# EAGLE design servo_shield_v1 (EAGLE 6.3)
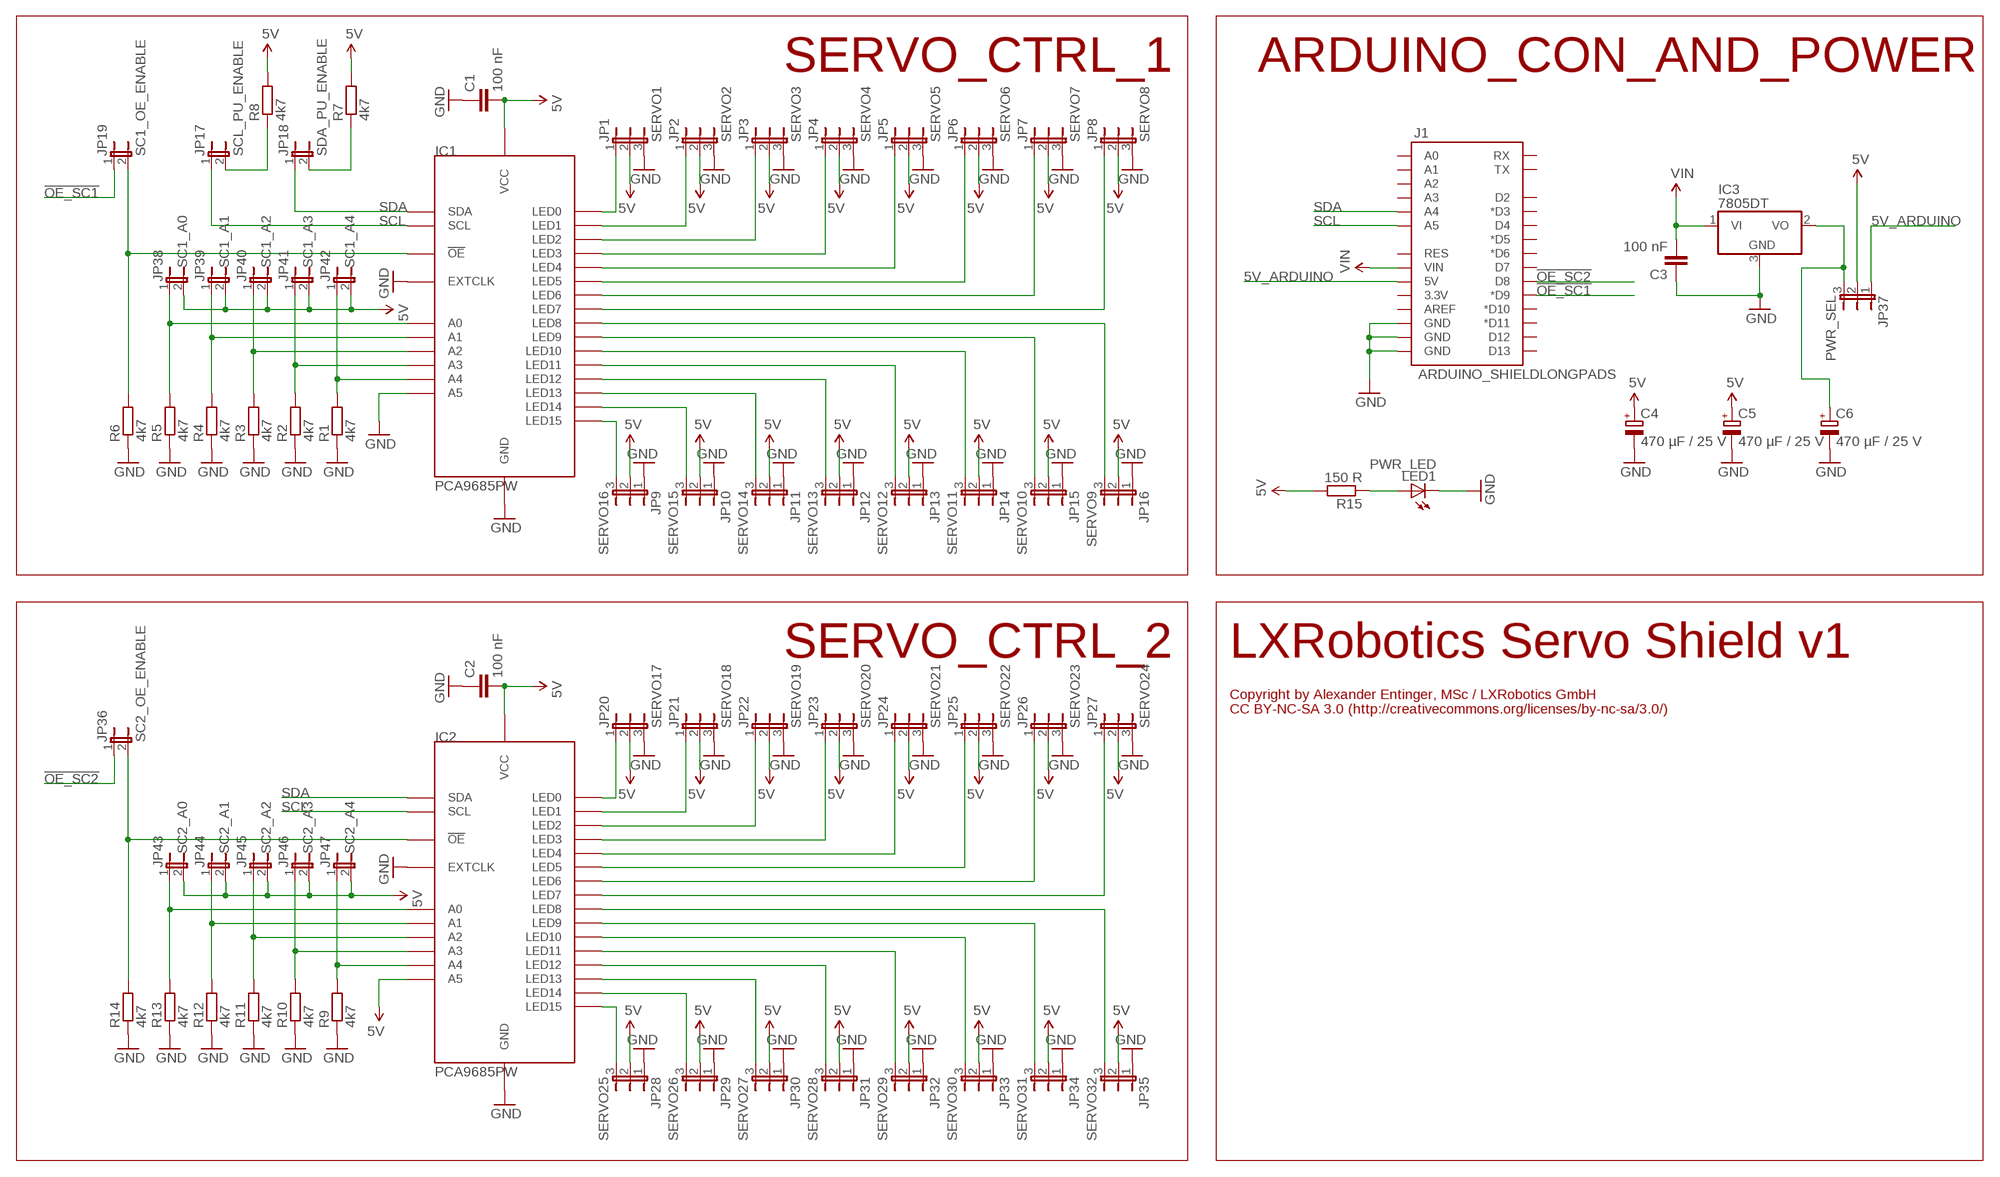
[diagram p0: schematic, sheet 1]

## Parts
C1  100 nF  C-EUC0805K  [C0805K]
C2  100 nF  C-EUC0805K  [C0805K]
C3  100 nF  C-EUC0805K  [C0805K]
C4  470 µF / 25 V  CPOL-EUE5-10.5  [E5-10,5]
C5  470 µF / 25 V  CPOL-EUE5-10.5  [E5-10,5]
C6  470 µF / 25 V  CPOL-EUE5-10.5  [E5-10,5]
IC1  PCA9685PW  [TSSOP28]
IC2  PCA9685PW  [TSSOP28]
IC3  7805DT  [TO252]
J1  ARDUINO_SHIELDLONGPADS  [DUEMILANOVE_SHIELD_LONGPADS]
JP1  SERVO1  JP2E  [JP2]
JP2  SERVO2  JP2E  [JP2]
JP3  SERVO3  JP2E  [JP2]
JP4  SERVO4  JP2E  [JP2]
JP5  SERVO5  JP2E  [JP2]
JP6  SERVO6  JP2E  [JP2]
JP7  SERVO7  JP2E  [JP2]
JP8  SERVO8  JP2E  [JP2]
JP9  SERVO16  JP2E  [JP2]
JP10  SERVO15  JP2E  [JP2]
JP11  SERVO14  JP2E  [JP2]
JP12  SERVO13  JP2E  [JP2]
JP13  SERVO12  JP2E  [JP2]
JP14  SERVO11  JP2E  [JP2]
JP15  SERVO10  JP2E  [JP2]
JP16  SERVO9  JP2E  [JP2]
JP17  SCL_PU_ENABLE  JP1E  [JP1]
JP18  SDA_PU_ENABLE  JP1E  [JP1]
JP19  SC1_OE_ENABLE  JP1E  [JP1]
JP20  SERVO17  JP2E  [JP2]
JP21  SERVO18  JP2E  [JP2]
JP22  SERVO19  JP2E  [JP2]
JP23  SERVO20  JP2E  [JP2]
JP24  SERVO21  JP2E  [JP2]
JP25  SERVO22  JP2E  [JP2]
JP26  SERVO23  JP2E  [JP2]
JP27  SERVO24  JP2E  [JP2]
JP28  SERVO25  JP2E  [JP2]
JP29  SERVO26  JP2E  [JP2]
JP30  SERVO27  JP2E  [JP2]
JP31  SERVO28  JP2E  [JP2]
JP32  SERVO29  JP2E  [JP2]
JP33  SERVO30  JP2E  [JP2]
JP34  SERVO31  JP2E  [JP2]
JP35  SERVO32  JP2E  [JP2]
JP36  SC2_OE_ENABLE  JP1E  [JP1]
JP37  PWR_SEL  JP2E  [JP2]
JP38  SC1_A0  JP1E  [JP1]
JP39  SC1_A1  JP1E  [JP1]
JP40  SC1_A2  JP1E  [JP1]
JP41  SC1_A3  JP1E  [JP1]
JP42  SC1_A4  JP1E  [JP1]
JP43  SC2_A0  JP1E  [JP1]
JP44  SC2_A1  JP1E  [JP1]
JP45  SC2_A2  JP1E  [JP1]
JP46  SC2_A3  JP1E  [JP1]
JP47  SC2_A4  JP1E  [JP1]
LED1  PWR_LED  LEDCHIPLED_0805  [CHIPLED_0805]
R1  4k7  R-EU_R0805W  [R0805W]
R2  4k7  R-EU_R0805W  [R0805W]
R3  4k7  R-EU_R0805W  [R0805W]
R4  4k7  R-EU_R0805W  [R0805W]
R5  4k7  R-EU_R0805W  [R0805W]
R6  4k7  R-EU_R0805W  [R0805W]
R7  4k7  R-EU_R0805W  [R0805W]
R8  4k7  R-EU_R0805W  [R0805W]
R9  4k7  R-EU_R0805W  [R0805W]
R10  4k7  R-EU_R0805W  [R0805W]
R11  4k7  R-EU_R0805W  [R0805W]
R12  4k7  R-EU_R0805W  [R0805W]
R13  4k7  R-EU_R0805W  [R0805W]
R14  4k7  R-EU_R0805W  [R0805W]
R15  150 R  R-EU_R0805W  [R0805W]

## Nets
5V: C1.2 C2.2 C4.+ C5.+ IC1.28(VCC) IC2.24(A5) IC2.28(VCC) JP1.2 JP2.2 JP3.2 JP4.2 JP5.2 JP6.2 JP7.2 JP8.2 JP9.2 JP10.2 JP11.2 JP12.2 JP13.2 JP14.2 JP15.2 JP16.2 JP20.2 JP21.2 JP22.2 JP23.2 JP24.2 JP25.2 JP26.2 JP27.2 JP28.2 JP29.2 JP30.2 JP31.2 JP32.2 JP33.2 JP34.2 JP35.2 JP37.2 JP38.2 JP39.2 JP40.2 JP41.2 JP42.2 JP43.2 JP44.2 JP45.2 JP46.2 JP47.2 R7.2 R8.2 R15.2
5V_ARDUINO: J1.5V JP37.1
!OE_SC1: J1.D9(*D9) JP19.1
!OE_SC2: J1.D8 JP36.1
GND: C1.1 C2.1 C3.1 C4.- C5.- C6.- IC1.14(GND) IC1.24(A5) IC1.25(EXTCLK) IC2.14(GND) IC2.25(EXTCLK) IC3.3(GND) J1.GND@0(GND) J1.GND@1(GND) J1.GND@2(GND) JP1.3 JP2.3 JP3.3 JP4.3 JP5.3 JP6.3 JP7.3 JP8.3 JP9.1 JP10.1 JP11.1 JP12.1 JP13.1 JP14.1 JP15.1 JP16.1 JP20.3 JP21.3 JP22.3 JP23.3 JP24.3 JP25.3 JP26.3 JP27.3 JP28.1 JP29.1 JP30.1 JP31.1 JP32.1 JP33.1 JP34.1 JP35.1 LED1.C R1.1 R2.1 R3.1 R4.1 R5.1 R6.1 R9.1 R10.1 R11.1 R12.1 R13.1 R14.1
N$1: IC1.6(LED0) JP1.1
N$2: IC1.7(LED1) JP2.1
N$3: IC1.8(LED2) JP3.1
N$4: IC1.9(LED3) JP4.1
N$5: IC1.10(LED4) JP5.1
N$6: IC1.11(LED5) JP6.1
N$7: IC1.12(LED6) JP7.1
N$8: IC1.13(LED7) JP8.1
N$9: IC1.22(LED15) JP9.3
N$10: IC1.21(LED14) JP10.3
N$11: IC1.20(LED13) JP11.3
N$12: IC1.19(LED12) JP12.3
N$13: IC1.18(LED11) JP13.3
N$14: IC1.17(LED10) JP14.3
N$15: IC1.16(LED9) JP15.3
N$16: IC1.15(LED8) JP16.3
N$17: IC1.5(A4) JP42.1 R1.2
N$18: IC1.4(A3) JP41.1 R2.2
N$19: IC1.3(A2) JP40.1 R3.2
N$20: IC1.2(A1) JP39.1 R4.2
N$21: IC1.1(A0) JP38.1 R5.2
N$22: IC1.23(!OE) JP19.2 R6.2
N$23: C6.+ IC3.2(VO) JP37.3
N$24: IC2.6(LED0) JP20.1
N$25: IC2.7(LED1) JP21.1
N$26: JP17.2 R8.1
N$27: JP18.2 R7.1
N$28: IC2.8(LED2) JP22.1
N$29: IC2.9(LED3) JP23.1
N$30: IC2.10(LED4) JP24.1
N$31: IC2.11(LED5) JP25.1
N$32: IC2.12(LED6) JP26.1
N$33: IC2.13(LED7) JP27.1
N$34: IC2.22(LED15) JP28.3
N$35: IC2.21(LED14) JP29.3
N$36: IC2.20(LED13) JP30.3
N$37: IC2.19(LED12) JP31.3
N$38: IC2.18(LED11) JP32.3
N$39: IC2.17(LED10) JP33.3
N$40: IC2.16(LED9) JP34.3
N$41: IC2.15(LED8) JP35.3
N$42: IC2.5(A4) JP47.1 R9.2
N$43: IC2.4(A3) JP46.1 R10.2
N$44: IC2.3(A2) JP45.1 R11.2
N$45: IC2.2(A1) JP44.1 R12.2
N$46: IC2.1(A0) JP43.1 R13.2
N$47: IC2.23(!OE) JP36.2 R14.2
N$48: LED1.A R15.1
SCL: IC1.26(SCL) IC2.26(SCL) J1.A5 JP17.1
SDA: IC1.27(SDA) IC2.27(SDA) J1.A4 JP18.1
VIN: C3.2 IC3.1(VI) J1.VIN
Unconnected: J1.3.3V J1.A0 J1.A1 J1.A2 J1.A3 J1.AREF J1.D2 J1.D3(*D3) J1.D4 J1.D5(*D5) J1.D6(*D6) J1.D7 J1.D10(*D10) J1.D11(*D11) J1.D12 J1.D13 J1.RES J1.RX J1.TX

## Notes on the sheet
- SERVO_CTRL_1 | ARDUINO_CON_AND_POWER
- SERVO_CTRL_2 | LXRobotics Servo Shield v1
- Copyright by Alexander Entinger, MSc / LXRobotics GmbH 
  CC BY-NC-SA 3.0 (http://creativecommons.org/licenses/by-nc-sa/3.0/)

## Library data of the parts
C1-C3 = resistor:C-EU: CAPACITOR, European symbol
C4-C6 = resistor:CPOL-EU: POLARIZED CAPACITOR, European symbol
IC1 IC2 = lxrobotics_ic:PCA9685
IC3 = linear:78*: Positive VOLTAGE REGULATOR Source: http://cache.national.com/ds/LM/LM78L05.pdf http://www.fairchildsemi.com/ds/LM/LM7805.pdf
J1 = SparkFun-Boards:ARDUINO_SHIELD: Arduino shield footprint
JP1-JP16 JP20-JP35 JP37 = jumper:JP2E: JUMPER
JP17-JP19 JP36 JP38-JP47 = jumper:JP1E: JUMPER
LED1 = led:LED: LED OSRAM: - CHIPLED LG R971, LG N971, LY N971, LG Q971, LY Q971, LO R971, LY R971 LH N974, LH R974 LS Q976, LO Q976, LY Q976 LO Q996 - Hyper CHIPLED LW Q18S LB Q993, LB Q99A, LB R99A - SideLED LS A670, LO A670, LY A670, LG A670, LP A670 LB A673, LV A673, LT A673, LW A673 LH A674 LY A675 LS A676, LA A676, LO A676, LY A676, LW A676 LS A679, LY A679, LG A679 - Hyper Micro SIDELED® LS Y876, LA Y876, LO Y876, LY Y876 LT Y87S - SmartLED LW L88C, LW L88S LB L89C, LB L89S, LG L890 LS L89K, LO L89K, LY L89K LS L896, LA L896, LO L896, LY L896 - TOPLED LS T670, LO T670, LY T670, LG T670, LP T670 LSG T670, LSP T670, LSY T670, LOP T670, LYG T670 LG T671, LOG T671, LSG T671 LB T673, LV T673, LT T673, LW T673 LH T674 LS T676, LA T676, LO T676, LY T676, LB T676, LH T676, LSB T676, LW T676 LB T67C, LV T67C, LT T67C, LS T67K, LO T67K, LY T67K, LW E67C LS E67B, LA E67B, LO E67B, LY E67B, LB E67C, LV E67C, LT E67C LW T67C LS T679, LY T679, LG T679 LS T770, LO T770, LY T770, LG T770, LP T770 LB T773, LV T773, LT T773, LW T773 LH T774 LS E675, LA E675, LY E675, LS T675 LS T776, LA T776, LO T776, LY T776, LB T776 LHGB T686 LT T68C, LB T68C - Hyper Mini TOPLED® LB M676 - Mini TOPLED Santana® LG M470 LS M47K, LO M47K, LY M47K Source: http://www.osram.convergy.de LUXEON: - LUMILED® LXK2-PW12-R00, LXK2-PW12-S00, LXK2-PW14-U00, LXK2-PW14-V00 LXK2-PM12-R00, LXK2-PM12-S00, LXK2-PM14-U00 LXK2-PE12-Q00, LXK2-PE12-R00, LXK2-PE12-S00, LXK2-PE14-T00, LXK2-PE14-U00 LXK2-PB12-K00, LXK2-PB12-L00, LXK2-PB12-M00, LXK2-PB14-N00, LXK2-PB14-P00, LXK2-PB14-Q00 LXK2-PR12-L00, LXK2-PR12-M00, LXK2-PR14-Q00, LXK2-PR14-R00 LXK2-PD12-Q00, LXK2-PD12-R00, LXK2-PD12-S00 LXK2-PH12-R00, LXK2-PH12-S00 LXK2-PL12-P00, LXK2-PL12-Q00, LXK2-PL12-R00 Source: www.luxeon.com KINGBRIGHT: KA-3528ASYC Source: www.kingbright.com
R1-R15 = resistor:R-EU_: RESISTOR, European symbol

## Board
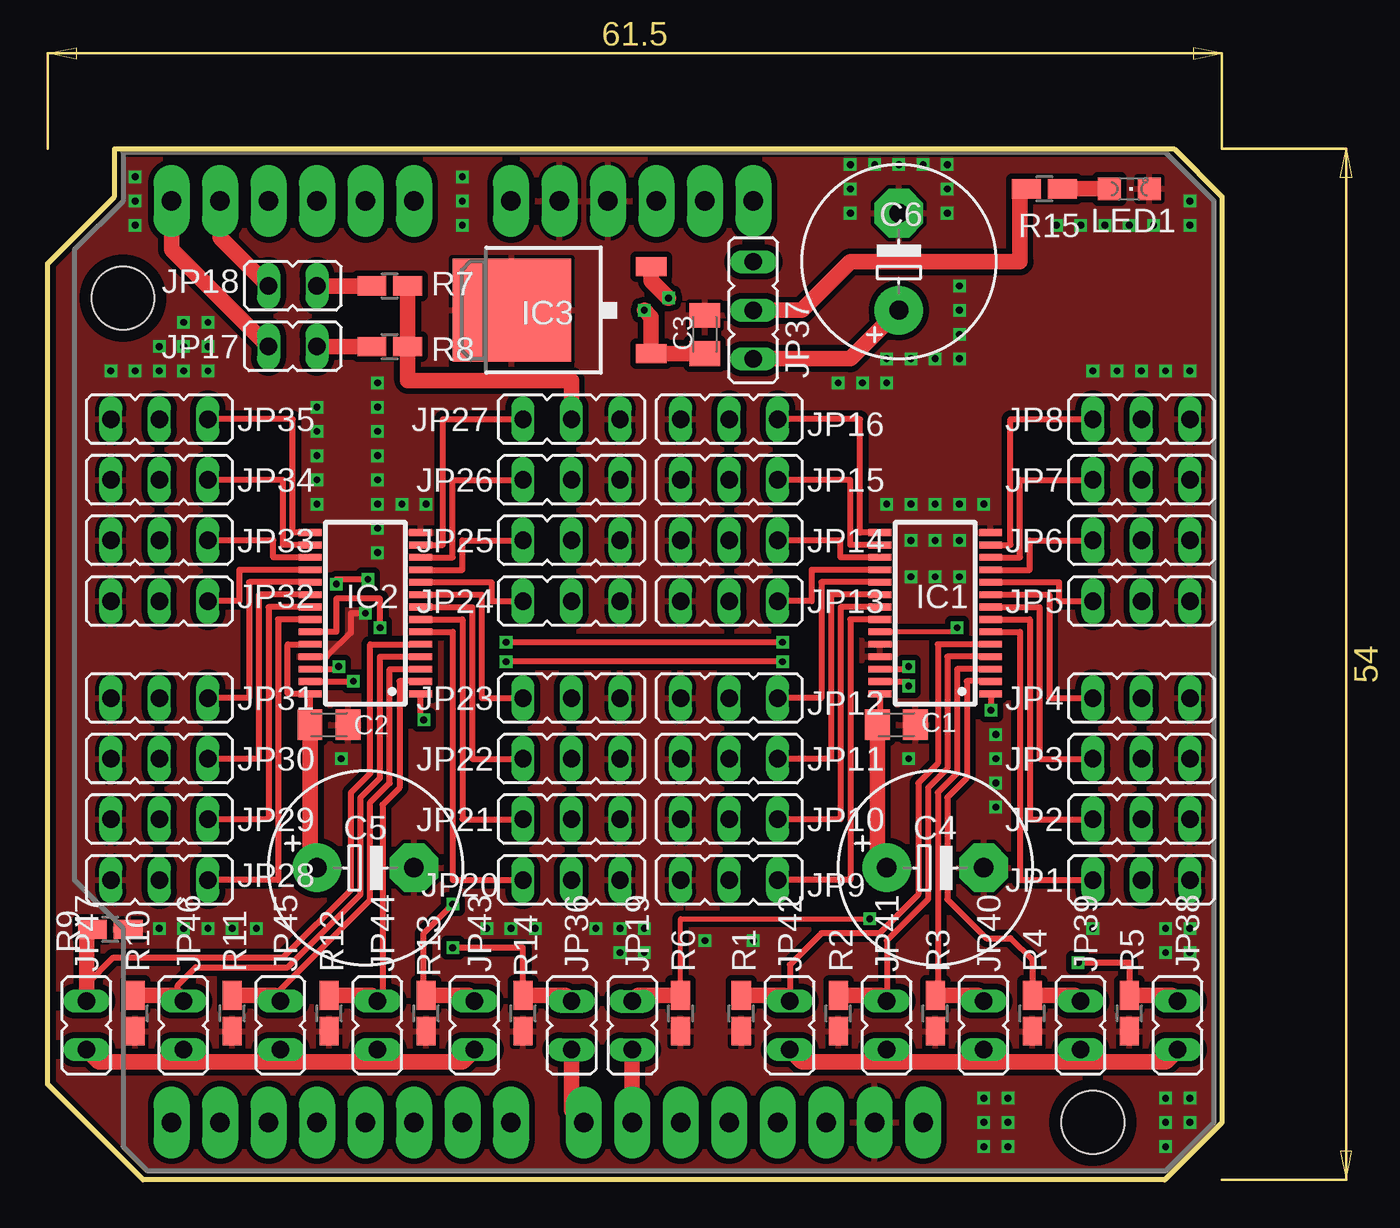
[diagram p1: board, top side]
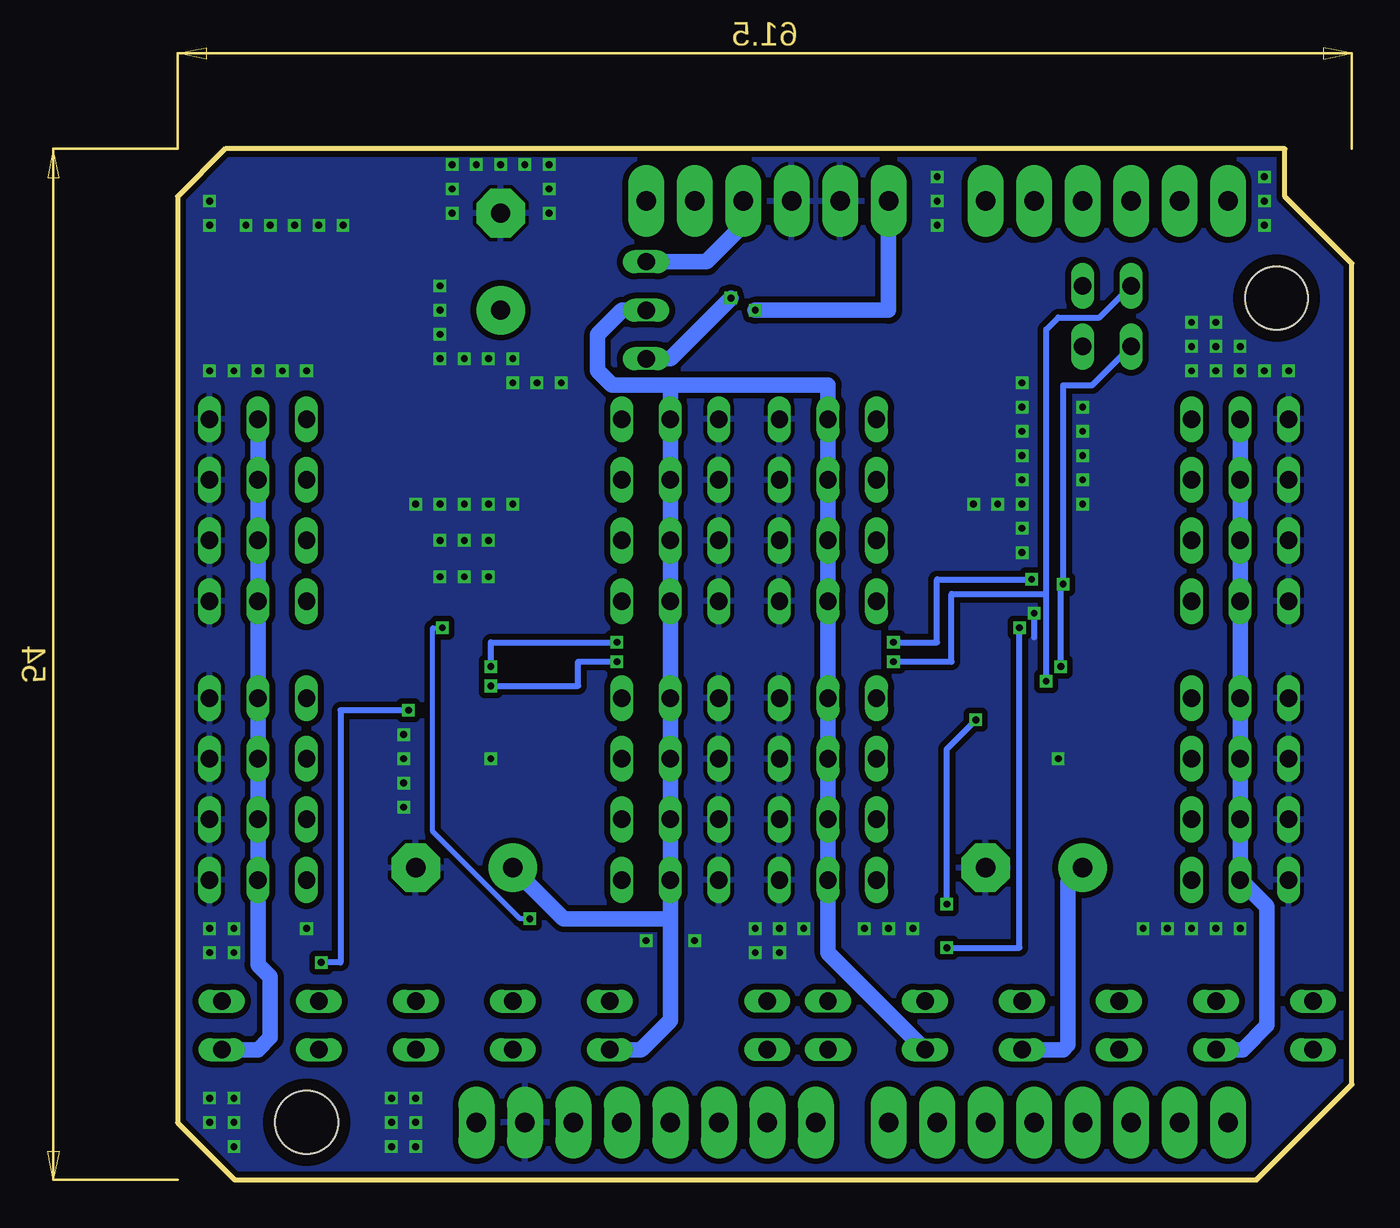
[diagram p2: board, bottom side, seen from below]

Size 61.5 x 54 mm. Coordinates in mm from the lower left corner, seen from the top.
Outline: 61.5,3 58.5,0 5,0 0,5 0,48 3.5,51.5 3.5,54 59,54 61.5,51.5 61.5,3
Copper layers (1*16): Top 0.035mm / dielectric 1.5mm / Bottom 0.035mm
Design rules "LeitOn - Standard-Eagle-DRU - 1- und  2-Lagen DK - deutsch - Rev 2.0": minimum track width 0.15mm, minimum drill 0.3mm, track to track 0.15mm, track to pad 0.15mm, pad to pad 0.15mm, via to via 0.15mm, smd to smd 0.15mm, copper to edge 0.3mm, drill to drill 0.3mm, minimum pad ring 0.15mm, minimum via ring 0.15mm, stop-mask expansion 0.075mm, vias tented up to drill 0mil, thermal gap 0.2mm

### Footprints (pad centres in the part's own frame; a part is rotated, then mirrored left to right if it is on the bottom)
C0805K = smd 1.3 x 1.6: 1 -1,0; 2 1,0
E5-10,5 = drill 1.016 pad 2.54: + -2.54,0 | drill 1.016 pad 2.54 octagon: - 2.54,0
TSSOP28 = smd 0.35 x 1.2: 1 -4.225,-2.9; 2 -3.575,-2.9; 3 -2.925,-2.9; 4 -2.275,-2.9; 5 -1.625,-2.9; 6 -0.975,-2.9; 7 -0.325,-2.9; 8 0.325,-2.9; 9 0.975,-2.9; 10 1.625,-2.9; 11 2.275,-2.9; 12 2.925,-2.9; 13 3.575,-2.9; 14 4.225,-2.9; 15 4.225,2.9; 16 3.575,2.9; 17 2.925,2.9; 18 2.275,2.9; 19 1.625,2.9; 20 0.975,2.9; 21 0.325,2.9; 22 -0.325,2.9; 23 -0.975,2.9; 24 -1.625,2.9; 25 -2.275,2.9; 26 -2.925,2.9; 27 -3.575,2.9; 28 -4.225,2.9
TO252 = smd 1 x 1.6: 1 -2.28,-4.8; 2 2.28,-4.8 | smd 5.4 x 6.2: 3 0,2.5
DUEMILANOVE_SHIELD_LONGPADS = drill 1.016 pad 1.88 long: 3.3V 50.8,26.67; 5V 50.8,29.21; A0 50.8,41.91; A1 50.8,44.45; A2 50.8,46.99; A3 50.8,49.53; A4 50.8,52.07; A5 50.8,54.61; AREF 2.54,15.24; D2 2.54,49.53; D3 2.54,46.99; D4 2.54,44.45; D5 2.54,41.91; D6 2.54,39.37; D7 2.54,36.83; D8 2.54,33.02; D9 2.54,30.48; D10 2.54,27.94; D11 2.54,25.4; D12 2.54,22.86; D13 2.54,20.32; GND@0 50.8,31.75; GND@1 50.8,34.29; GND@2 2.54,17.78; RES 50.8,24.13; RX 2.54,54.61; TX 2.54,52.07; VIN 50.8,36.83 | hole 3.302: 45.72,57.15; 2.54,6.35
JP2 = drill 0.914 long: 1 -2.54,0; 2 0,0; 3 2.54,0
JP1 = drill 0.914 long: 1 0,-1.27; 2 0,1.27
CHIPLED_0805 = smd 1.2 x 1.2: A 0,-1.05; C 0,1.05
R0805W = smd 1.5 x 1: 1 -0.94,0; 2 0.94,0

### Placement (x,y rotation side)
C1  44.45,23.84 180 top
C2  14.73,23.84 180 top
C3  34.42,44.28 270 top
C4  46.48,16.34 0 top
C5  16.64,16.34 0 top
C6  44.58,48.09 90 top
IC1  46.48,29.68 90 top
IC2  16.64,29.68 90 top
IC3  26.8,45.55 90 top
J1  61.09,0.47 90 top
JP1  57.28,15.71 0 top
JP2  57.28,18.88 0 top
JP3  57.28,22.06 0 top
JP4  57.28,25.23 0 top
JP5  57.28,30.31 0 top
JP6  57.28,33.49 0 top
JP7  57.28,36.66 0 top
JP8  57.28,39.84 0 top
JP9  35.69,15.71 0 top
JP10  35.69,18.88 0 top
JP11  35.69,22.06 0 top
JP12  35.69,25.23 0 top
JP13  35.69,30.31 0 top
JP14  35.69,33.49 0 top
JP15  35.69,36.66 0 top
JP16  35.69,39.84 0 top
JP17  12.83,43.65 270 top
JP18  12.83,46.83 270 top
JP19  30.61,8.09 0 top
JP20  27.44,15.71 0 top
JP21  27.44,18.88 0 top
JP22  27.44,22.06 0 top
JP23  27.44,25.23 0 top
JP24  27.44,30.31 0 top
JP25  27.44,33.49 0 top
JP26  27.44,36.66 0 top
JP27  27.44,39.84 0 top
JP28  5.84,15.71 0 top
JP29  5.84,18.88 0 top
JP30  5.84,22.06 0 top
JP31  5.84,25.23 0 top
JP32  5.84,30.31 0 top
JP33  5.84,33.49 0 top
JP34  5.84,36.66 0 top
JP35  5.84,39.84 0 top
JP36  27.44,8.09 0 top
JP37  36.96,45.55 270 top
JP38  59.19,8.09 180 top
JP39  54.11,8.09 180 top
JP40  49.03,8.09 180 top
JP41  43.94,8.09 180 top
JP42  38.87,8.09 180 top
JP43  22.35,8.09 180 top
JP44  17.27,8.09 180 top
JP45  12.2,8.09 180 top
JP46  7.11,8.09 180 top
JP47  2.04,8.09 180 top
LED1  56.64,51.91 270 top
R1  36.33,8.73 90 top
R2  41.41,8.73 90 top
R3  46.48,8.73 90 top
R4  51.56,8.73 90 top
R5  56.64,8.73 90 top
R6  33.15,8.73 90 top
R7  17.91,46.83 0 top
R8  17.91,43.65 0 top
R9  3.27,13.12 180 top
R10  4.57,8.73 90 top
R11  9.66,8.73 90 top
R12  14.73,8.73 90 top
R13  19.81,8.73 90 top
R14  24.9,8.73 90 top
R15  52.2,51.91 180 top

### Tracks (layer width: path | path; a pad name or v marks a point on that pad's centre or on a via)
5V
  Top 0.305: IC1.28 43.58,23.84 C1.2 | C2.2 IC2.28 arc-90 IC2.28 12.58,25.45 12.58,28.05 IC2.24
  Top 0.813: R7.2 R8.2 18.85,41.87 27.44,41.87 JP27.2 | JP37.2 39.5,45.55 42.04,48.09 50.93,48.09 50.93,51.58 R15.2 | JP42.2 39.5,6.18 43.94,6.18 | 43.94,6.18 49.03,6.18 | 49.03,6.18 54.11,6.18 | 54.11,6.18 58.55,6.18 JP38.2 | JP41.2 43.94,6.18 | JP40.2 49.03,6.18 | JP39.2 54.11,6.18 | C4.+ 43.45,16.34 C1.2 | JP47.2 2.67,6.18 7.11,6.18 | 7.11,6.18 12.2,6.18 | 12.2,6.18 17.27,6.18 | 17.27,6.18 21.72,6.18 JP43.2 | JP44.2 17.27,6.18 | JP45.2 12.2,6.18 | JP46.2 7.11,6.18 | C2.2 13.73,16.71 arc90 C5.+
  Bottom 0.813: JP8.2 JP7.2 JP6.2 JP5.2 JP4.2 JP3.2 JP2.2 JP1.2 57.28,11.27 56.64,10.63 56.64,7.45 57.28,6.82 JP38.2 | JP37.2 38.23,45.55 39.5,44.28 39.5,42.38 38.74,41.62 35.69,41.62 | 35.69,13.68 35.69,8.34 37.21,6.82 JP42.2 | 35.69,13.68 JP9.2 JP10.2 JP11.2 JP12.2 JP13.2 JP14.2 JP15.2 JP16.2 35.69,41.62 | 35.69,13.68 41.28,13.68 C4.+ | JP35.2 JP34.2 JP33.2 JP32.2 JP31.2 JP30.2 JP29.2 JP28.2 4.45,14.31 4.45,8.09 5.72,6.82 JP46.2 | 35.69,41.62 27.44,41.62 JP27.2 JP26.2 JP25.2 JP24.2 JP23.2 JP22.2 JP21.2 JP20.2 27.44,11.9 JP43.2 | C5.+ 14.86,15.58 14.86,7.07 15.12,6.82 JP44.2
5V_ARDUINO
  Bottom 0.813: JP37.1 33.78,48.09 31.88,50 J1.5V
!OE_SC1
  Top 0.813: J1.D9 JP19.1
!OE_SC2
  Top 0.813: J1.D8 27.44,3.64 JP36.1
GND  (via drill 0.36)
  Top 0.305: IC2.25 14.62,27.41 15.88,28.66 15.88,29.68 v16.64,29.68
  Bottom 0.305: v16.64,29.68 16.64,28.41
  other vias: 45.09,22.06 15.37,22.06 5.84,13.17 7.11,13.17 8.38,13.17 9.66,13.17 10.92,13.17 22.99,13.17 24.26,13.17 25.53,13.17 28.7,13.17 29.98,13.17 29.98,11.9 31.24,11.9 31.24,13.17 34.42,12.54 36.96,12.54 54.74,13.17 58.55,13.17 59.82,13.17 59.82,11.9 58.55,11.9 49.03,4.28 50.3,4.28 49.03,3.01 50.3,3.01 49.03,1.74 50.3,1.74 58.55,4.28 59.82,4.28 58.55,3.01 59.82,3.01 58.55,1.74 3.3,42.38 4.57,42.38 5.84,42.38 5.84,43.65 7.11,44.92 7.11,43.65 7.11,42.38 8.38,42.38 8.38,43.65 8.38,44.92 14.1,40.48 14.1,39.2 14.1,37.94 14.1,36.66 14.1,35.4 17.27,32.85 17.27,34.12 19.81,35.4 18.55,35.4 17.27,35.4 17.27,36.66 17.27,37.94 17.27,39.2 17.27,40.48 17.27,41.74 4.57,50 4.57,51.27 4.57,52.54 21.72,52.54 21.72,51.27 21.72,50 42.04,50.64 42.04,51.91 42.04,53.17 43.31,53.17 44.58,53.17 45.85,53.17 47.12,53.17 47.12,51.91 47.12,50.64 59.82,51.27 59.82,50 57.92,50 56.64,50 55.38,50 54.11,50 52.83,50 59.82,42.38 58.55,42.38 57.28,42.38 56.01,42.38 54.74,42.38 47.75,46.83 47.75,45.55 47.75,44.28 47.75,43.02 46.48,43.02 45.22,43.02 43.94,43.02 43.94,41.74 42.67,41.74 41.41,41.74 43.94,35.4 45.22,35.4 46.48,35.4 47.75,35.4 49.03,35.4 45.22,33.49 46.48,33.49 47.75,33.49 45.22,31.59 46.48,31.59 47.75,31.59 49.66,23.33 49.66,22.06 49.66,20.79 49.66,19.52
  pour Bottom (isolate 0.305): 58.55,53.81 61.09,51.27 61.09,3.01 58.55,0.47 5.21,0.47 0.39,5.29 0.39,47.72 3.94,51.27 3.94,53.81
  pour Top (isolate 0.305): 61.09,3.01 58.55,0.47 5.21,0.47 0.39,5.29 0.39,47.72 3.94,51.27 3.94,53.81 58.55,53.81 61.09,51.27
N$1
  Top 0.305: IC1.6 50.93,28.7 50.93,15.71 JP1.1
N$2
  Top 0.305: IC1.7 51.44,29.35 51.44,18.88 JP2.1
N$3
  Top 0.305: IC1.8 51.95,30.01 51.95,22.06 JP3.1
N$4
  Top 0.305: IC1.9 52.45,30.66 52.45,25.23 JP4.1
N$5
  Top 0.305: IC1.10 52.96,31.3 52.96,30.31 JP5.1
N$6
  Top 0.305: IC1.11 51.44,31.95 51.44,33.49 JP6.1
N$7
  Top 0.305: IC1.12 50.93,32.6 50.93,36.66 JP7.1
N$8
  Top 0.305: IC1.13 50.42,33.26 50.42,39.84 JP8.1
N$9
  Top 0.305: IC1.22 42.04,29.35 42.04,15.71 JP9.3
N$10
  Top 0.305: IC1.21 41.53,30.01 41.53,18.88 JP10.3
N$11
  Top 0.305: IC1.20 41.02,30.66 41.02,22.06 JP11.3
N$12
  Top 0.305: IC1.19 40.52,31.3 40.52,25.23 JP12.3
N$13
  Top 0.305: IC1.18 40.01,31.95 40.01,30.31 JP13.3
N$14
  Top 0.305: IC1.17 41.53,32.6 41.53,33.49 JP14.3
N$15
  Top 0.305: IC1.16 42.04,33.26 42.04,36.66 JP15.3
N$16
  Top 0.305: IC1.15 42.55,33.91 42.55,39.84 JP16.3
N$17
  Top 0.305: IC1.5 46.61,28.05 46.61,21.81 45.6,20.79 45.6,14.95 43.56,12.92 40.52,12.92 38.87,11.27 JP42.1
  Top 0.813: JP42.1 38.56,9.66 R1.2
N$18
  Top 0.305: IC1.4 47.12,27.41 47.12,21.55 46.1,20.54 46.1,14.69 43.94,12.54 JP41.1
  Top 0.813: JP41.1 43.64,9.66 R2.2
N$19
  Top 0.305: IC1.3 47.63,26.76 47.63,21.3 46.61,20.28 46.61,9.66 R3.2
  Top 0.813: JP40.1 48.72,9.66 R3.2
N$20
  Top 0.305: IC1.2 49.39,26.12 48.14,26.12 48.14,21.04 47.12,20.03 47.12,14.69 49.15,12.66 50.42,12.66 51.56,11.52 R4.2
  Top 0.813: JP39.1 53.8,9.66 R4.2
N$21  (via drill 0.36)
  Top 0.305: IC1.1 49.41,25.43 v49.41,24.6 | v53.98,11.39 56.64,11.39 R5.2
  Top 0.813: JP38.1 58.88,9.66 R5.2
  Bottom 0.305: v49.41,24.6 52.96,24.6 52.96,11.39 v53.98,11.39
N$22  (via drill 0.36)
  Top 0.254: R6.2 33.15,13.68 v43.06,13.68 | v47.63,28.92 47.42,28.7 IC1.23
  Top 0.813: JP19.2 30.91,9.66 R6.2
  Bottom 0.254: v47.63,28.92 48.14,28.92 48.14,18.25 43.56,13.68 v43.06,13.68
N$23  (via drill 0.36)
  Top 0.813: C6.+ 42.04,43.02 JP37.3 | v32.52,46.19 31.6,47.1 IC3.2
  Bottom 0.813: JP37.3 35.69,43.02 v32.52,46.19
N$24
  Top 0.305: IC2.6 21.21,28.7 21.21,15.71 JP20.1
N$25
  Top 0.305: IC2.7 21.72,29.35 21.72,18.88 JP21.1
N$26
  Top 0.813: R8.1 JP17.2
N$27
  Top 0.813: R7.1 JP18.2
N$28
  Top 0.305: IC2.8 22.23,30.01 22.23,22.06 JP22.1
N$29
  Top 0.305: IC2.9 22.74,30.66 22.74,25.23 JP23.1
N$30
  Top 0.305: IC2.10 23.24,31.3 23.24,30.31 JP24.1
N$31
  Top 0.305: IC2.11 21.72,31.95 21.72,33.49 JP25.1
N$32
  Top 0.305: IC2.12 21.21,32.6 21.21,36.66 JP26.1
N$33
  Top 0.305: IC2.13 20.7,33.26 20.7,39.84 JP27.1
N$34
  Top 0.305: IC2.22 12.07,29.35 12.07,15.71 JP28.3
N$35
  Top 0.305: IC2.21 11.56,30.01 11.56,18.88 JP29.3
N$36
  Top 0.305: IC2.20 11.05,30.66 11.05,22.06 JP30.3
N$37
  Top 0.305: IC2.19 10.54,31.3 10.54,25.23 JP31.3
N$38
  Top 0.305: IC2.18 10.04,31.95 10.04,30.31 JP32.3
N$39
  Top 0.305: IC2.17 11.81,32.6 11.81,33.49 JP33.3
N$40
  Top 0.305: IC2.16 12.32,33.26 12.32,36.66 JP34.3
N$41
  Top 0.305: IC2.15 12.83,33.91 12.83,39.84 JP35.3
N$42
  Top 0.305: JP47.1 2.04,10.25 3.43,11.65 12.32,11.65 15.88,15.2 15.88,20.28 16.89,21.3 16.89,28.05 IC2.5
  Top 0.813: R9.2 2.04,13.12 JP47.1
N$43
  Top 0.305: 6.81,9.66 6.81,10.2 7.75,11.14 12.58,11.14 16.39,14.95 16.39,20.03 17.4,21.04 17.4,27.41 IC2.4
  Top 0.813: JP46.1 6.81,9.66 R10.2
N$44
  Top 0.305: 11.89,9.66 16.89,14.67 16.89,19.77 17.91,20.79 17.91,26.76 IC2.3
  Top 0.813: JP45.1 11.89,9.66 R11.2
N$45
  Top 0.305: IC2.2 19.52,26.12 18.42,26.12 18.42,20.54 17.53,19.65 17.53,9.36 JP44.1
  Top 0.813: JP44.1 16.97,9.66 R12.2
N$46  (via drill 0.36)
  Top 0.305: R13.2 arc-90 19.69,9.79 19.69,12.92 v21.21,14.44 | v19.69,24.09 19.54,24.24 IC2.1
  Top 0.813: JP43.1 22.05,9.66 R13.2
  Bottom 0.305: v21.21,14.44 21.21,22.57 v19.69,24.09
N$47  (via drill 0.36)
  Top 0.305: R14.2 24.9,12.15 v21.21,12.15 | v17.4,28.92 17.4,30.44 15.12,30.44 15.12,28.7 IC2.23
  Top 0.813: JP36.2 27.13,9.66 R14.2
  Bottom 0.305: v21.21,12.15 17.4,12.15 v17.4,28.92
N$48
  Top 0.813: R15.1 LED1.A
SCL  (via drill 0.36)
  Top 0.305: IC1.26 45.09,26.76 v45.09,26.89 | v38.48,28.16 v24.01,28.16 | v16.77,31.46 15.12,31.46 v15.12,31.2 | IC2.26 15.12,26.76 v15.24,26.89
  Top 0.813: JP17.1 6.48,48.73 J1.A5
  Bottom 0.305: JP17.1 13.59,41.62 15.12,41.62 v15.12,31.2 15.24,31.2 v15.24,26.89 | v45.09,26.89 45.09,28.16 v38.48,28.16 | v24.01,28.16 21.72,28.16 21.72,31.46 v16.77,31.46
SDA  (via drill 0.36)
  Top 0.305: IC1.27 45.09,26.1 v45.09,25.87 | v38.48,27.14 v24.01,27.14 | IC2.27 15.88,26.1 v16.01,26.12
  Top 0.813: JP18.1 9.02,49.37 J1.A4
  Bottom 0.305: v16.01,26.12 16.01,30.7 | 16.01,30.7 16.01,44.54 15.37,45.17 13.21,45.17 JP18.1 | v45.09,25.87 40.52,25.87 40.52,27.14 v38.48,27.14 | v24.01,27.14 20.96,27.14 20.96,30.7 16.01,30.7
VIN  (via drill 0.36)
  Top 0.813: C3.2 33.77,43.27 IC3.1 31.6,45.2 v31.24,45.55
  Bottom 0.813: J1.VIN 24.26,45.55 v31.24,45.55